# EAGLE design driver (EAGLE 9.6.2)
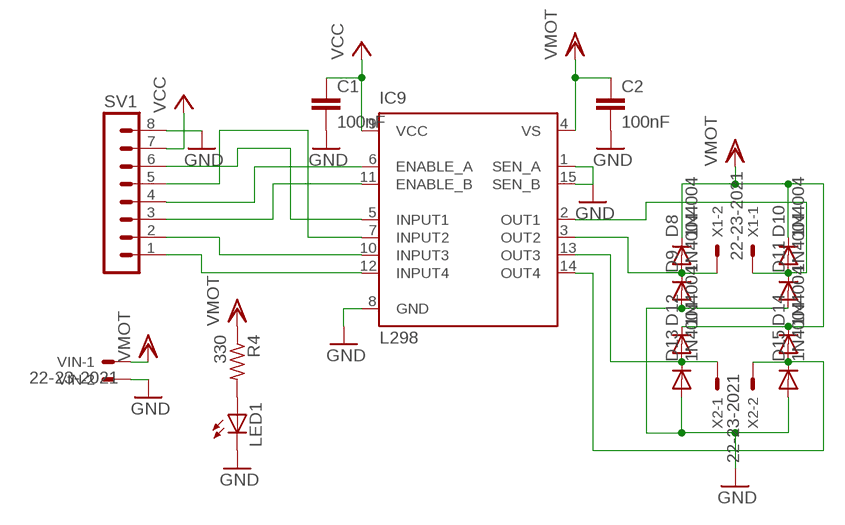
[diagram p0: schematic, sheet 1]

## Parts
C1  100nF  C-EU025-025X050  [C025-025X050]
C2  100nF  C-EU025-025X050  [C025-025X050]
D8  1N4004  [DO41-10]
D9  1N4004  [DO41-10]
D10  1N4004  [DO41-10]
D11  1N4004  [DO41-10]
D12  1N4004  [DO41-10]
D13  1N4004  [DO41-10]
D14  1N4004  [DO41-10]
D15  1N4004  [DO41-10]
IC9  L298  [MULTIWATT-15]
LED1  LED3MM  [LED3MM]
R4  330  R-US_0207/10  [0207/10]
SV1  MA08-1  [MA08-1]
VIN  22-23-2021  [22-23-2021]
X1  22-23-2021  [22-23-2021]
X2  22-23-2021  [22-23-2021]

## Nets
GND: C1.2 C2.2 D9.A D11.A D13.A D15.A IC9.1(SEN_A) IC9.8(GND) IC9.15(SEN_B) LED1.K(C) SV1.8 VIN.2
N$1: IC9.5(INPUT1) SV1.6
N$3: IC9.7(INPUT2) SV1.5
N$5: IC9.12(INPUT4) SV1.1
N$8: IC9.10(INPUT3) SV1.2
N$16: IC9.6(ENABLE_A) SV1.4
N$17: IC9.11(ENABLE_B) SV1.3
N$44: LED1.A R4.2
N$204: D8.A D9.C IC9.3(OUT2) X1.2
N$205: D10.A D11.C IC9.2(OUT1) X1.1
N$206: D12.A D13.C IC9.13(OUT3) X2.1
N$207: D14.A D15.C IC9.14(OUT4) X2.2
VCC: C1.1 IC9.9(VCC) SV1.7
VDD: C2.1 D8.C D10.C D12.C D14.C IC9.4(VS) R4.1 VIN.1 ; supply symbol labelled VMOT

## Library data of the parts
C1 C2 = rcl:C-EU: CAPACITOR, European symbol
D8-D15 = diode:1N4004: DIODE general purpose rectifier, 1 A
IC9 = st-microelectronics:L298: DUAL FULL-BRIDGE DRIVER
LED1 = led:LED: LED OSRAM: - CHIPLED LG R971, LG N971, LY N971, LG Q971, LY Q971, LO R971, LY R971 LH N974, LH R974 LS Q976, LO Q976, LY Q976 LO Q996 - Hyper CHIPLED LW Q18S LB Q993, LB Q99A, LB R99A - SideLED LS A670, LO A670, LY A670, LG A670, LP A670 LB A673, LV A673, LT A673, LW A673 LH A674 LY A675 LS A676, LA A676, LO A676, LY A676, LW A676 LS A679, LY A679, LG A679 - Hyper Micro SIDELED® LS Y876, LA Y876, LO Y876, LY Y876 LT Y87S - SmartLED LW L88C, LW L88S LB L89C, LB L89S, LG L890 LS L89K, LO L89K, LY L89K LS L896, LA L896, LO L896, LY L896 - TOPLED LS T670, LO T670, LY T670, LG T670, LP T670 LSG T670, LSP T670, LSY T670, LOP T670, LYG T670 LG T671, LOG T671, LSG T671 LB T673, LV T673, LT T673, LW T673 LH T674 LS T676, LA T676, LO T676, LY T676, LB T676, LH T676, LSB T676, LW T676 LB T67C, LV T67C, LT T67C, LS T67K, LO T67K, LY T67K, LW E67C LS E67B, LA E67B, LO E67B, LY E67B, LB E67C, LV E67C, LT E67C LW T67C LS T679, LY T679, LG T679 LS T770, LO T770, LY T770, LG T770, LP T770 LB T773, LV T773, LT T773, LW T773 LH T774 LS E675, LA E675, LY E675, LS T675 LS T776, LA T776, LO T776, LY T776, LB T776 LHGB T686 LT T68C, LB T68C - Hyper Mini TOPLED® LB M676 - Mini TOPLED Santana® LG M470 LS M47K, LO M47K, LY M47K Source: http://www.osram.convergy.de LUXEON: - LUMILED® LXK2-PW12-R00, LXK2-PW12-S00, LXK2-PW14-U00, LXK2-PW14-V00 LXK2-PM12-R00, LXK2-PM12-S00, LXK2-PM14-U00 LXK2-PE12-Q00, LXK2-PE12-R00, LXK2-PE12-S00, LXK2-PE14-T00, LXK2-PE14-U00 LXK2-PB12-K00, LXK2-PB12-L00, LXK2-PB12-M00, LXK2-PB14-N00, LXK2-PB14-P00, LXK2-PB14-Q00 LXK2-PR12-L00, LXK2-PR12-M00, LXK2-PR14-Q00, LXK2-PR14-R00 LXK2-PD12-Q00, LXK2-PD12-R00, LXK2-PD12-S00 LXK2-PH12-R00, LXK2-PH12-S00 LXK2-PL12-P00, LXK2-PL12-Q00, LXK2-PL12-R00 Source: www.luxeon.com KINGBRIGHT: KA-3528ASYC Source: www.kingbright.com
R4 = rcl:R-US_: RESISTOR, American symbol
SV1 = con-lstb:MA08-1: PIN HEADER; OC_FARNELL: unknown; OC_NEWARK: unknown
VIN X1 X2 = con-molex:22-23-2021: .100" (2.54mm) Center Header - 2 Pin; MF: MOLEX; MPN: 22-23-2021; OC_FARNELL: 1462926; OC_NEWARK: 25C3832

## Board
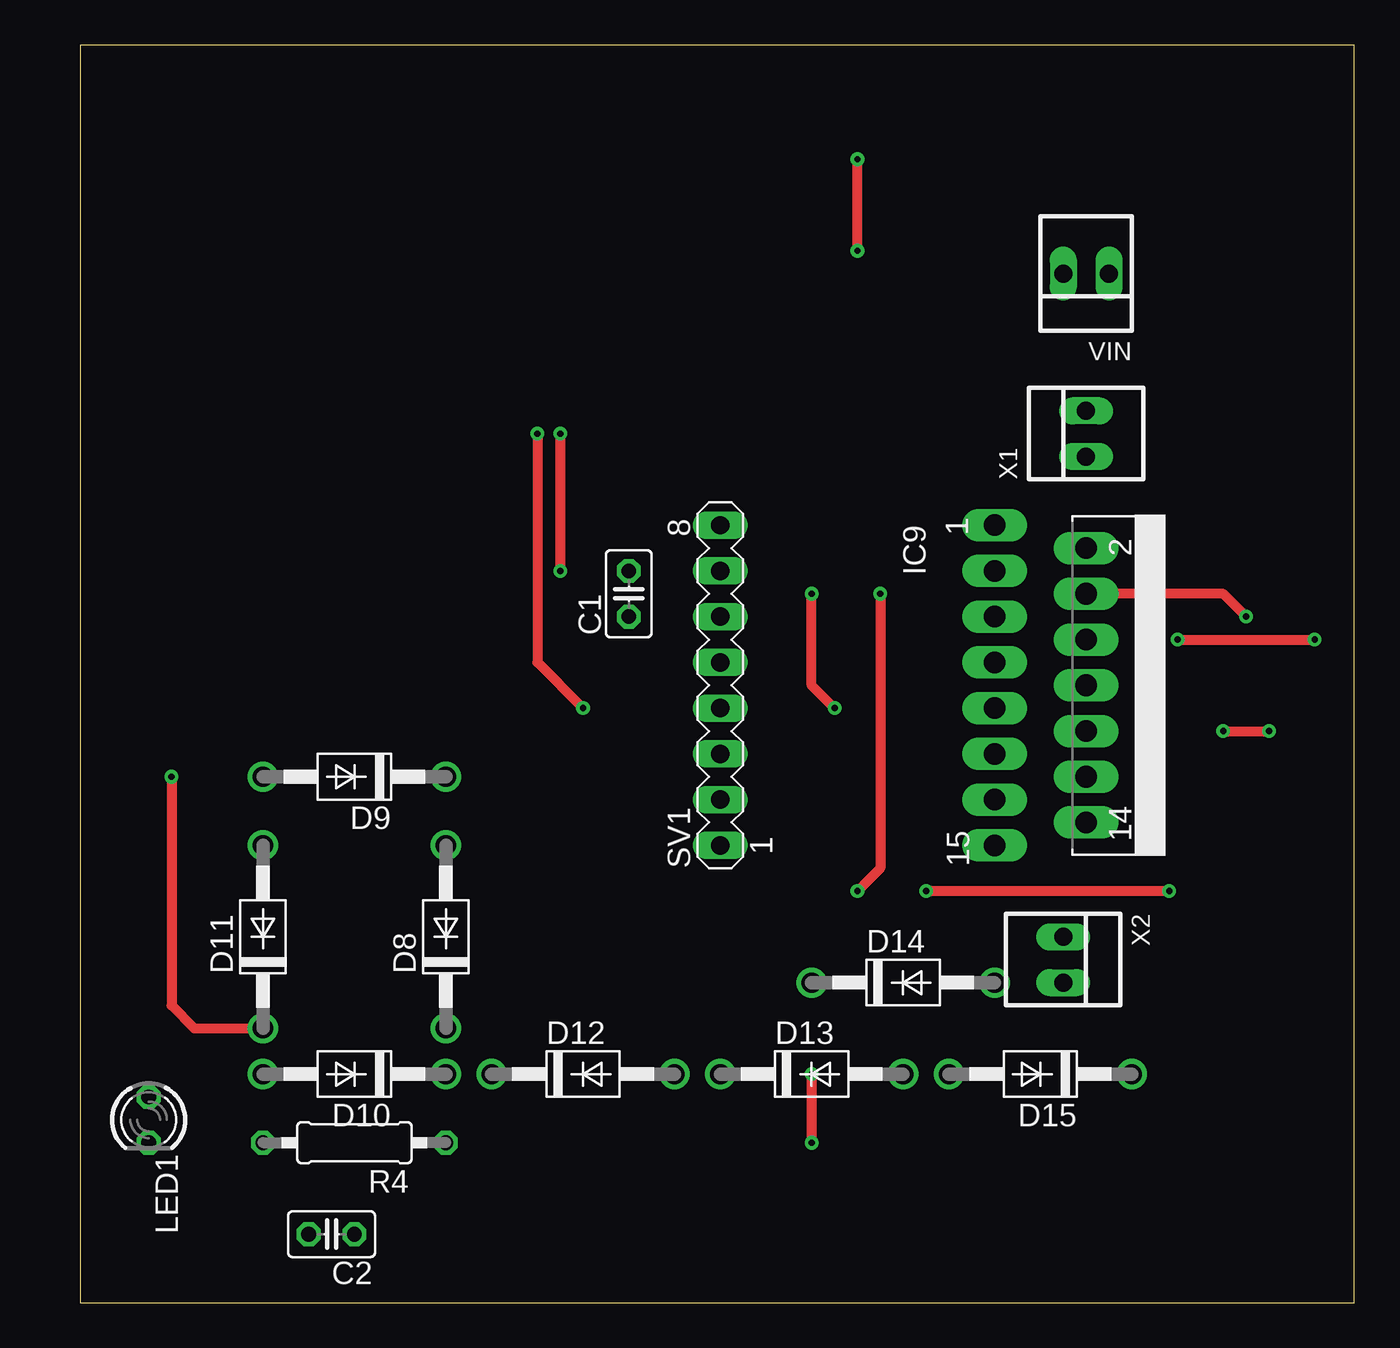
[diagram p1: board, top side]
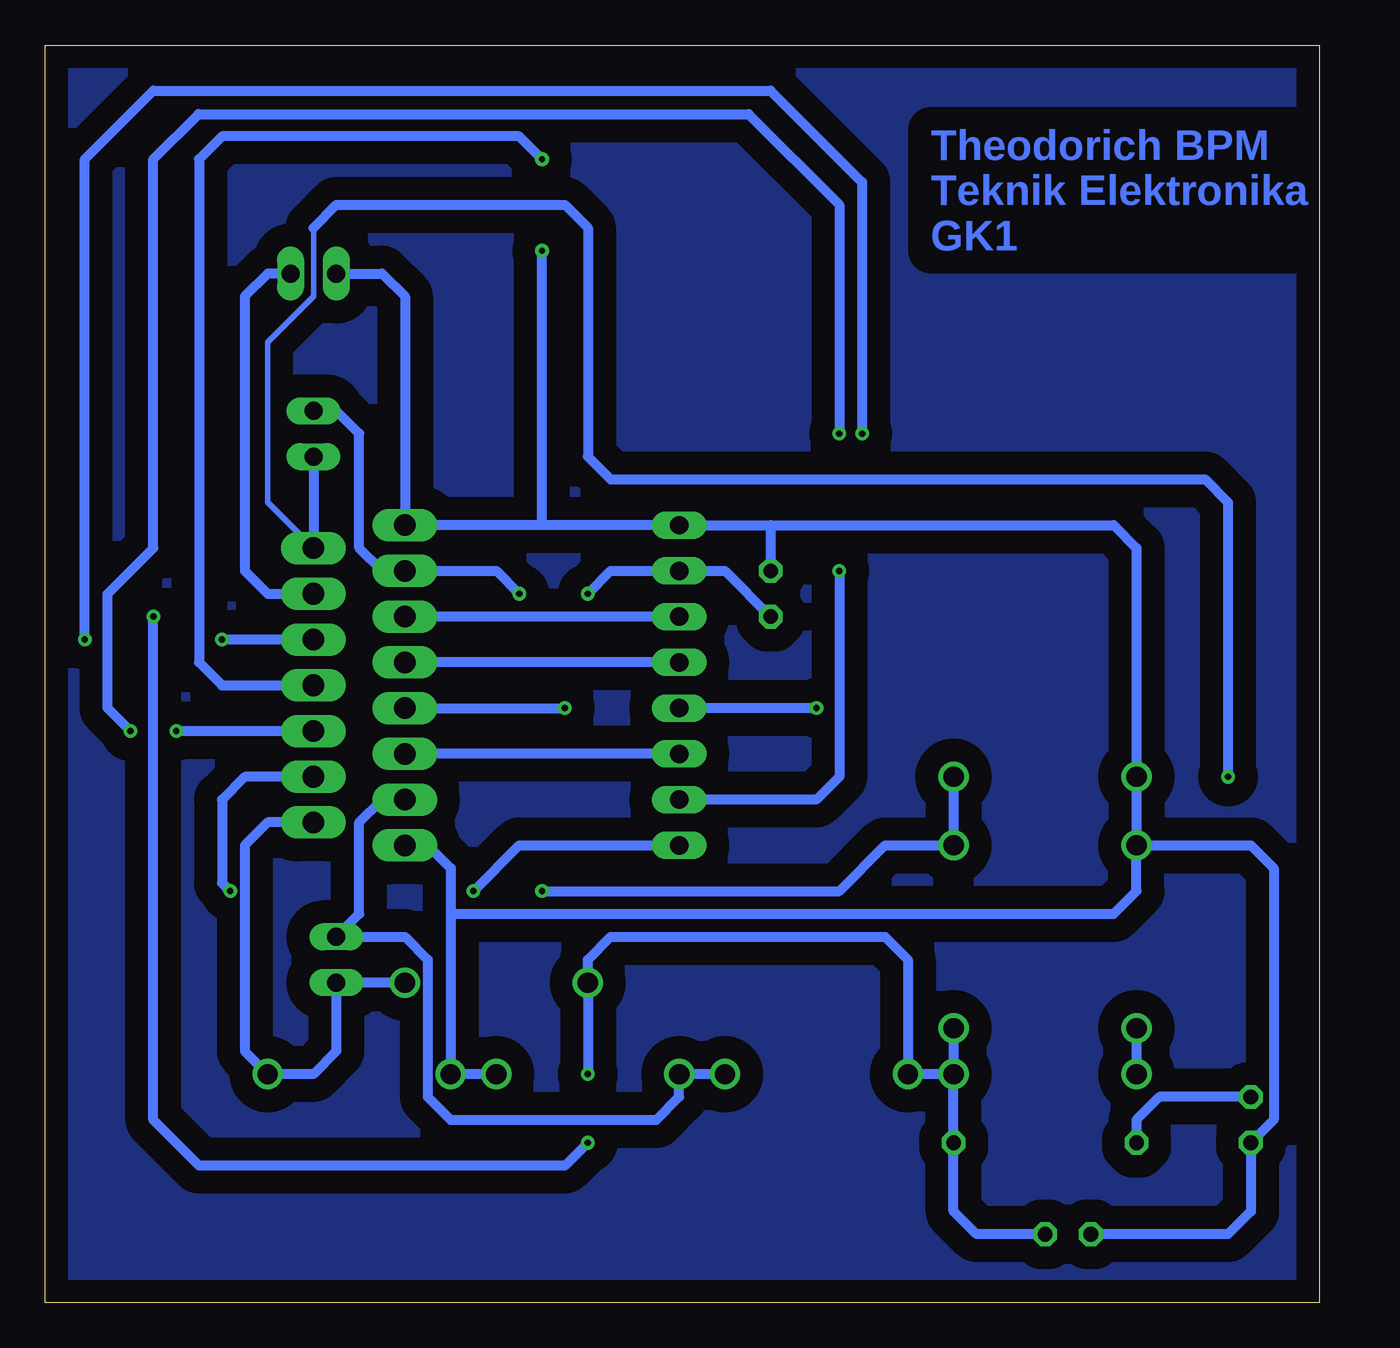
[diagram p2: board, bottom side, seen from below]

Size 70.79 x 69.84 mm. Coordinates in mm from the lower left corner, seen from the top.
Outline: 0,0 70.79,0 70.79,69.84 0,69.84 0,0
Copper layers (1*16): Top 0.035mm / dielectric 1.5mm / Bottom 0.035mm
Design rules "default": minimum track width 6mil, minimum drill 0.35mm, track to track 6mil, track to pad 6mil, pad to pad 6mil, via to via 6mil, smd to smd 6mil, copper to edge 40mil, drill to drill 6mil, minimum pad ring 10mil, minimum via ring 8mil, stop-mask expansion 4mil, vias tented up to drill 0mil, thermal gap 10mil

### Footprints (pad centres in the part's own frame; a part is rotated, then mirrored left to right if it is on the bottom)
C025-025X050 = drill 0.813 octagon: 1 -1.27,0; 2 1.27,0
DO41-10 = drill 1.118: A 5.08,0; C -5.08,0
MULTIWATT-15 = drill 1.2 long: 1 -8.89,-7.62; 2 -7.62,-2.54; 3 -6.35,-7.62; 4 -5.08,-2.54; 5 -3.81,-7.62; 6 -2.54,-2.54; 7 -1.27,-7.62; 8 0,-2.54; 9 1.27,-7.62; 10 2.54,-2.54; 11 3.81,-7.62; 12 5.08,-2.54; 13 6.35,-7.62; 14 7.62,-2.54; 15 8.89,-7.62
LED3MM = drill 0.813 octagon: A -1.27,0; K 1.27,0
0207/10 = drill 0.813 octagon: 1 -5.08,0; 2 5.08,0
MA08-1 = drill 1.016 long: 1 -8.89,0; 2 -6.35,0; 3 -3.81,0; 4 -1.27,0; 5 1.27,0; 6 3.81,0; 7 6.35,0; 8 8.89,0
22-23-2021 = drill 1 long: 1 -1.27,0; 2 1.27,0

### Placement (x,y rotation side)
C1  30.48,39.37 90 top
C2  13.97,3.81 180 top
D8  20.32,20.32 90 top
D9  15.24,29.21 180 top
D10  15.24,12.7 180 top
D11  10.16,20.32 90 top
D12  27.94,12.7 0 top
D13  40.64,12.7 0 top
D14  45.72,17.78 0 top
D15  53.34,12.7 180 top
IC9  58.42,34.29 270 top
LED1  3.81,10.16 270 top
R4  15.24,8.89 180 top
SV1  35.56,34.29 90 top
VIN  55.88,57.15 180 top
X1  55.88,48.26 90 top
X2  54.61,19.05 270 top

### Tracks (layer width: path | path; a pad name or v marks a point on that pad's centre or on a via)
GND  (via drill 0.35)
  Top 0.559: v43.18,58.42 v43.18,63.5
  Bottom 0.559: D13.A D15.A 48.26,21.59 | D11.A D9.A 10.16,41.91 11.43,43.18 30.48,43.18 | IC9.15 49.53,25.4 48.26,24.13 48.26,21.59 | VIN.2 52.07,57.15 50.8,55.88 IC9.1 43.18,43.18 | 43.18,43.18 SV1.8 30.48,43.18 | D11.A 3.81,25.4 2.54,24.13 2.54,10.16 LED1.K 3.81,5.08 5.08,3.81 C2.2 | 30.48,43.18 C1.2 | 43.18,43.18 v43.18,58.42 | v43.18,63.5 44.45,64.77 60.96,64.77 62.23,63.5 62.23,35.56 60.96,34.29 IC9.8 | 48.26,21.59 11.43,21.59 10.16,22.86 D11.A
N$1
  Bottom 0.559: SV1.6 IC9.5
N$2
  pour Bottom (isolate 1.27): 0,69.85 71.12,69.85 71.12,0 0,0
N$3
  Bottom 0.559: SV1.5 IC9.7
N$5  (via drill 0.35)
  Top 0.559: v60.5,22.86 v46.99,22.86
  Bottom 0.559: IC9.12 59.69,29.21 60.96,27.94 60.96,23.32 v60.5,22.86 | v46.99,22.86 44.45,25.4 SV1.1
N$8  (via drill 0.35)
  Top 0.559: v63.5,31.75 v66.04,31.75 | v26.67,48.26 v26.67,40.64
  Bottom 0.559: v66.04,31.75 67.31,33.02 67.31,39.37 64.77,41.91 64.77,63.5 62.27,66 31.71,66 26.67,60.96 v26.67,48.26 | v26.67,40.64 26.67,29.21 27.94,27.94 SV1.2 | IC9.10 v63.5,31.75
N$16  (via drill 0.35)
  Top 0.559: v60.96,36.83 v68.58,36.83 | v25.4,48.26 25.4,35.56 v27.94,33.02
  Bottom 0.559: IC9.6 v60.96,36.83 | v68.58,36.83 68.58,63.5 64.77,67.31 30.48,67.31 25.4,62.23 v25.4,48.26 | v27.94,33.02 SV1.4
N$17
  Bottom 0.559: SV1.3 IC9.11
N$44
  Bottom 0.559: LED1.A 8.89,11.43 10.16,10.16 R4.2
N$204  (via drill 0.35)
  Top 0.559: v44.45,39.37 44.45,24.13 v43.18,22.86
  Bottom 0.559: D9.C D8.A 24.13,25.4 26.67,22.86 v43.18,22.86 | X1.2 54.61,49.53 53.34,48.26 53.34,41.91 52.07,40.64 IC9.3 45.72,40.64 v44.45,39.37
N$205  (via drill 0.35)
  Top 0.559: v5.08,29.21 5.08,16.51 6.35,15.24 D11.C
  Bottom 0.305: IC9.2 58.42,44.45 58.42,53.34 55.88,55.88 55.88,59.69
  Bottom 0.559: D11.C D10.A | X1.1 IC9.2 | 55.88,59.69 54.61,60.96 41.91,60.96 40.64,59.69 40.64,46.99 39.37,45.72 6.35,45.72 5.08,44.45 v5.08,29.21
N$206
  Bottom 0.559: D12.A D13.C 35.56,11.43 36.83,10.16 48.26,10.16 49.53,11.43 49.53,19.05 50.8,20.32 X2.1 53.34,21.59 53.34,26.67 52.07,27.94 IC9.13
N$207
  Bottom 0.559: IC9.14 58.42,26.67 59.69,25.4 59.69,13.97 D15.C 55.88,12.7 54.61,13.97 X2.2 D14.A
VCC  (via drill 0.35)
  Top 0.559: v41.91,33.02 40.64,34.29 v40.64,39.37
  Bottom 0.559: C1.1 33.02,40.64 SV1.7 39.37,40.64 v40.64,39.37 | IC9.9 v41.91,33.02
VDD  (via drill 0.35)
  Top 0.559: v40.64,12.7 v40.64,8.89 | v64.77,38.1 63.5,39.37 IC9.4
  Bottom 0.559: D10.C R4.1 20.32,5.08 19.05,3.81 C2.1 | D10.C D12.C 22.86,19.05 24.13,20.32 39.37,20.32 40.64,19.05 D14.C v40.64,12.7 | D8.C D10.C | VIN.1 58.42,57.15 59.69,55.88 59.69,40.64 58.42,39.37 IC9.4 | v40.64,8.89 41.91,7.62 62.23,7.62 64.77,10.16 v64.77,38.1

### Text on the board
Bottom: Theodorich BPM / Teknik Elektronika / GK1